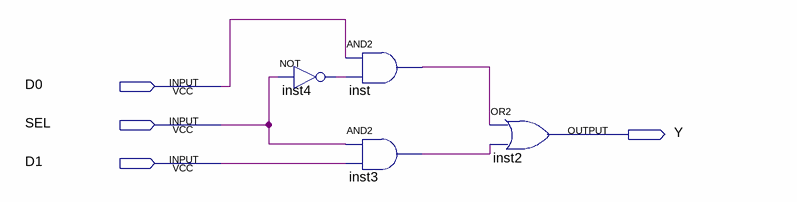
[diagram p0: schematic sheet]
// Quartus schematic MUX1.bdf as structural Verilog: 4 symbols, 4 pins
module MUX1 (
  input  D0,
  input  SEL,
  input  D1,
  output Y
);

  wire inst3_out, inst4_out, inst_out;

  not inst4 (inst4_out, SEL);
  and inst (inst_out, D0, inst4_out);
  and inst3 (inst3_out, SEL, D1);
  or inst2 (Y, inst_out, inst3_out);
endmodule
